# EAGLE design single-gates-THT (EAGLE 6.5.0)
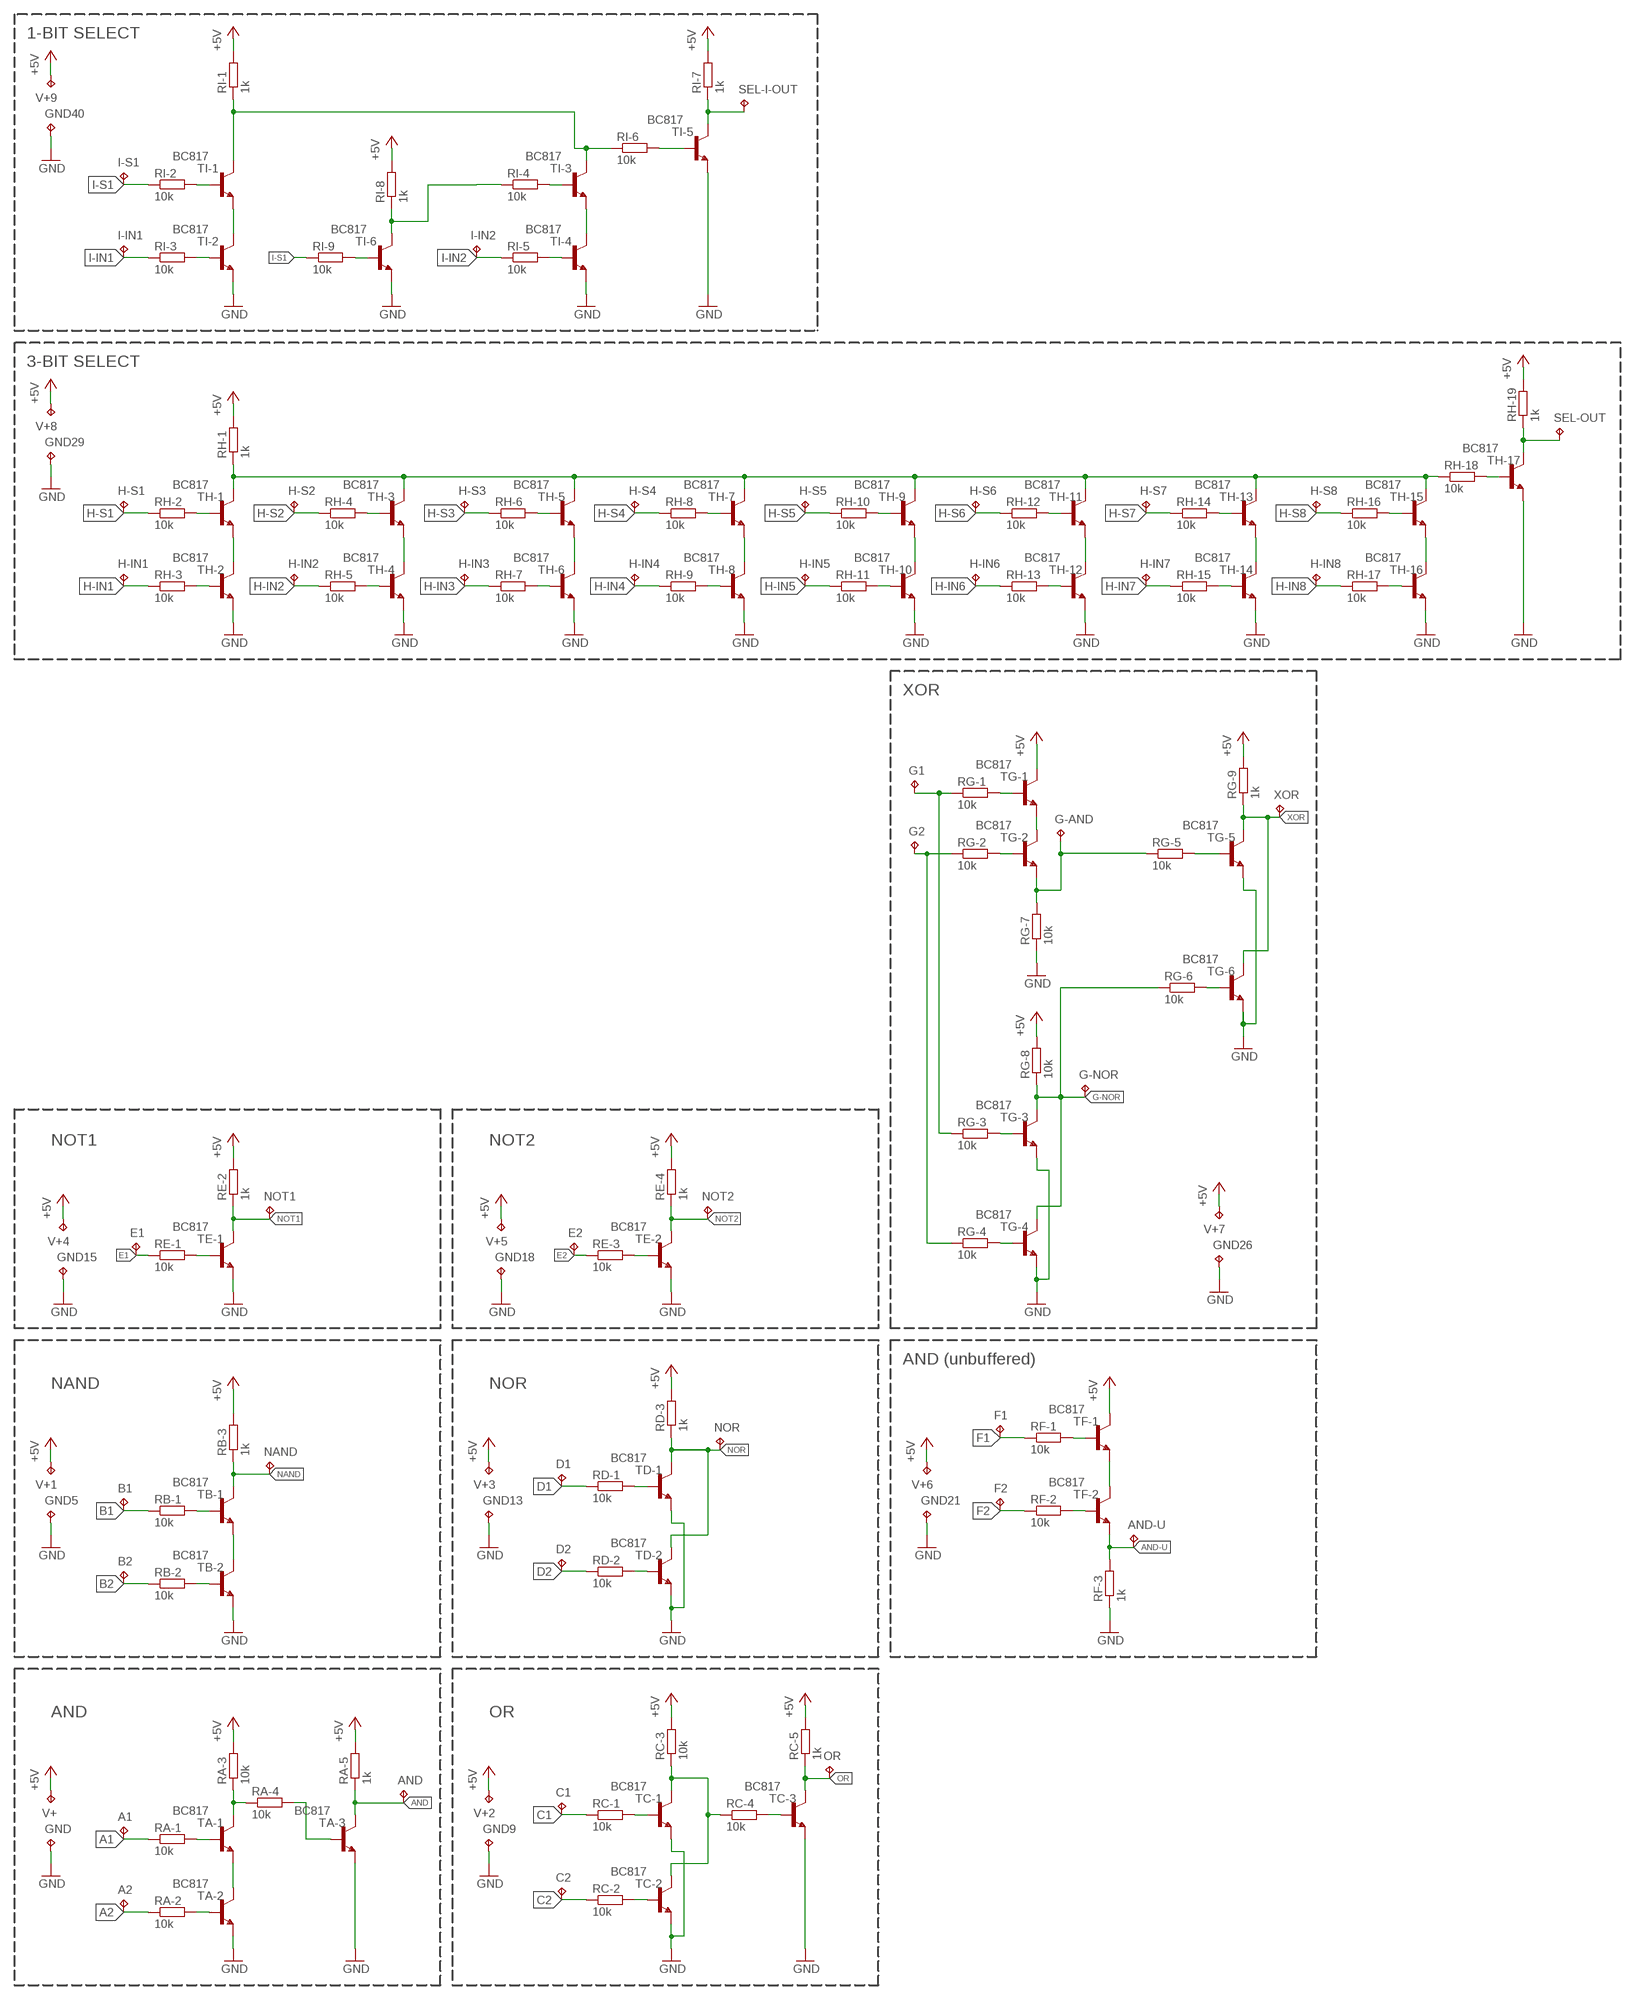
[diagram p0: schematic, sheet 1]

## Parts
A1  TPTP07R  [TP07R]
A2  TPTP07R  [TP07R]
AND  TPTP07R  [TP07R]
AND-U  TPTP07R  [TP07R]
B1  TPTP07R  [TP07R]
B2  TPTP07R  [TP07R]
C1  TPTP07R  [TP07R]
C2  TPTP07R  [TP07R]
D1  TPTP07R  [TP07R]
D2  TPTP07R  [TP07R]
E1  TPTP07R  [TP07R]
E2  TPTP07R  [TP07R]
F1  TPTP07R  [TP07R]
F2  TPTP07R  [TP07R]
G1  TPTP07R  [TP07R]
G2  TPTP07R  [TP07R]
G-AND  TPTP07R  [TP07R]
G-NOR  TPTP07R  [TP07R]
GND  TPTP07R  [TP07R]
GND5  TPTP07R  [TP07R]
GND9  TPTP07R  [TP07R]
GND13  TPTP07R  [TP07R]
GND15  TPTP07R  [TP07R]
GND18  TPTP07R  [TP07R]
GND21  TPTP07R  [TP07R]
GND26  TPTP07R  [TP07R]
GND29  TPTP07R  [TP07R]
GND40  TPTP07R  [TP07R]
H-IN1  TPTP07R  [TP07R]
H-IN2  TPTP07R  [TP07R]
H-IN3  TPTP07R  [TP07R]
H-IN4  TPTP07R  [TP07R]
H-IN5  TPTP07R  [TP07R]
H-IN6  TPTP07R  [TP07R]
H-IN7  TPTP07R  [TP07R]
H-IN8  TPTP07R  [TP07R]
H-S1  TPTP07R  [TP07R]
H-S2  TPTP07R  [TP07R]
H-S3  TPTP07R  [TP07R]
H-S4  TPTP07R  [TP07R]
H-S5  TPTP07R  [TP07R]
H-S6  TPTP07R  [TP07R]
H-S7  TPTP07R  [TP07R]
H-S8  TPTP07R  [TP07R]
I-IN1  TPTP07R  [TP07R]
I-IN2  TPTP07R  [TP07R]
I-S1  TPTP07R  [TP07R]
NAND  TPTP07R  [TP07R]
NOR  TPTP07R  [TP07R]
NOT1  TPTP07R  [TP07R]
NOT2  TPTP07R  [TP07R]
OR  TPTP07R  [TP07R]
RA-1  10k  R-EU_0207/7  [0207/7]
RA-2  10k  R-EU_0207/7  [0207/7]
RA-3  10k  R-EU_0207/7  [0207/7]
RA-4  10k  R-EU_0207/7  [0207/7]
RA-5  1k  R-EU_0207/7  [0207/7]
RB-1  10k  R-EU_0207/7  [0207/7]
RB-2  10k  R-EU_0207/7  [0207/7]
RB-3  1k  R-EU_0207/7  [0207/7]
RC-1  10k  R-EU_0207/7  [0207/7]
RC-2  10k  R-EU_0207/7  [0207/7]
RC-3  10k  R-EU_0207/7  [0207/7]
RC-4  10k  R-EU_0207/7  [0207/7]
RC-5  1k  R-EU_0207/7  [0207/7]
RD-1  10k  R-EU_0207/7  [0207/7]
RD-2  10k  R-EU_0207/7  [0207/7]
RD-3  1k  R-EU_0207/7  [0207/7]
RE-1  10k  R-EU_0207/7  [0207/7]
RE-2  1k  R-EU_0207/7  [0207/7]
RE-3  10k  R-EU_0207/7  [0207/7]
RE-4  1k  R-EU_0207/7  [0207/7]
RF-1  10k  R-EU_0207/7  [0207/7]
RF-2  10k  R-EU_0207/7  [0207/7]
RF-3  1k  R-EU_0207/7  [0207/7]
RG-1  10k  R-EU_0207/7  [0207/7]
RG-2  10k  R-EU_0207/7  [0207/7]
RG-3  10k  R-EU_0207/7  [0207/7]
RG-4  10k  R-EU_0207/7  [0207/7]
RG-5  10k  R-EU_0207/7  [0207/7]
RG-6  10k  R-EU_0207/7  [0207/7]
RG-7  10k  R-EU_0207/7  [0207/7]
RG-8  10k  R-EU_0207/7  [0207/7]
RG-9  1k  R-EU_0207/7  [0207/7]
RH-1  1k  R-EU_0207/7  [0207/7]
RH-2  10k  R-EU_0207/7  [0207/7]
RH-3  10k  R-EU_0207/7  [0207/7]
RH-4  10k  R-EU_0207/7  [0207/7]
RH-5  10k  R-EU_0207/7  [0207/7]
RH-6  10k  R-EU_0207/7  [0207/7]
RH-7  10k  R-EU_0207/7  [0207/7]
RH-8  10k  R-EU_0207/7  [0207/7]
RH-9  10k  R-EU_0207/7  [0207/7]
RH-10  10k  R-EU_0207/7  [0207/7]
RH-11  10k  R-EU_0207/7  [0207/7]
RH-12  10k  R-EU_0207/7  [0207/7]
RH-13  10k  R-EU_0207/7  [0207/7]
RH-14  10k  R-EU_0207/7  [0207/7]
RH-15  10k  R-EU_0207/7  [0207/7]
RH-16  10k  R-EU_0207/7  [0207/7]
RH-17  10k  R-EU_0207/7  [0207/7]
RH-18  10k  R-EU_0207/7  [0207/7]
RH-19  1k  R-EU_0207/7  [0207/7]
RI-1  1k  R-EU_0207/7  [0207/7]
RI-2  10k  R-EU_0207/7  [0207/7]
RI-3  10k  R-EU_0207/7  [0207/7]
RI-4  10k  R-EU_0207/7  [0207/7]
RI-5  10k  R-EU_0207/7  [0207/7]
RI-6  10k  R-EU_0207/7  [0207/7]
RI-7  1k  R-EU_0207/7  [0207/7]
RI-8  1k  R-EU_0207/7  [0207/7]
RI-9  10k  R-EU_0207/7  [0207/7]
SEL-I-OUT  TPTP07R  [TP07R]
SEL-OUT  TPTP07R  [TP07R]
TA-1  BC817  BC547A  [TO92]
TA-2  BC817  BC547A  [TO92]
TA-3  BC817  BC547A  [TO92]
TB-1  BC817  BC547A  [TO92]
TB-2  BC817  BC547A  [TO92]
TC-1  BC817  BC547A  [TO92]
TC-2  BC817  BC547A  [TO92]
TC-3  BC817  BC547A  [TO92]
TD-1  BC817  BC547A  [TO92]
TD-2  BC817  BC547A  [TO92]
TE-1  BC817  BC547A  [TO92]
TE-2  BC817  BC547A  [TO92]
TF-1  BC817  BC547A  [TO92]
TF-2  BC817  BC547A  [TO92]
TG-1  BC817  BC547A  [TO92]
TG-2  BC817  BC547A  [TO92]
TG-3  BC817  BC547A  [TO92]
TG-4  BC817  BC547A  [TO92]
TG-5  BC817  BC547A  [TO92]
TG-6  BC817  BC547A  [TO92]
TH-1  BC817  BC547A  [TO92]
TH-2  BC817  BC547A  [TO92]
TH-3  BC817  BC547A  [TO92]
TH-4  BC817  BC547A  [TO92]
TH-5  BC817  BC547A  [TO92]
TH-6  BC817  BC547A  [TO92]
TH-7  BC817  BC547A  [TO92]
TH-8  BC817  BC547A  [TO92]
TH-9  BC817  BC547A  [TO92]
TH-10  BC817  BC547A  [TO92]
TH-11  BC817  BC547A  [TO92]
TH-12  BC817  BC547A  [TO92]
TH-13  BC817  BC547A  [TO92]
TH-14  BC817  BC547A  [TO92]
TH-15  BC817  BC547A  [TO92]
TH-16  BC817  BC547A  [TO92]
TH-17  BC817  BC547A  [TO92]
TI-1  BC817  BC547A  [TO92]
TI-2  BC817  BC547A  [TO92]
TI-3  BC817  BC547A  [TO92]
TI-4  BC817  BC547A  [TO92]
TI-5  BC817  BC547A  [TO92]
TI-6  BC817  BC547A  [TO92]
V+  TPTP07R  [TP07R]
V+1  TPTP07R  [TP07R]
V+2  TPTP07R  [TP07R]
V+3  TPTP07R  [TP07R]
V+4  TPTP07R  [TP07R]
V+5  TPTP07R  [TP07R]
V+6  TPTP07R  [TP07R]
V+7  TPTP07R  [TP07R]
V+8  TPTP07R  [TP07R]
V+9  TPTP07R  [TP07R]
XOR  TPTP07R  [TP07R]

## Nets
+5V: RA-3.2 RA-5.2 RB-3.2 RC-3.2 RC-5.2 RD-3.2 RE-2.2 RE-4.2 RG-8.2 RG-9.2 RH-1.2 RH-19.2 RI-1.2 RI-7.2 RI-8.2 TF-1.3(C) TG-1.3(C) V+1.TP V+2.TP V+3.TP V+4.TP V+5.TP V+6.TP V+7.TP V+8.TP V+9.TP V+.TP
A1: A1.TP RA-1.1
A2: A2.TP RA-2.1
AND: AND.TP RA-5.1 TA-3.3(C)
AND-U: AND-U.TP RF-3.2 TF-2.1(E)
B1: B1.TP RB-1.1
B2: B2.TP RB-2.1
C1: C1.TP RC-1.1
C2: C2.TP RC-2.1
D1: D1.TP RD-1.1
D2: D2.TP RD-2.1
E1: E1.TP RE-1.1
E2: E2.TP RE-3.1
F1: F1.TP RF-1.1
F2: F2.TP RF-2.1
G-AND: G-AND.TP RG-5.1 RG-7.2 TG-2.1(E)
G-NOR: G-NOR.TP RG-6.1 RG-8.1 TG-3.3(C) TG-4.3(C)
GND: GND5.TP GND9.TP GND13.TP GND15.TP GND18.TP GND21.TP GND26.TP GND29.TP GND40.TP GND.TP RF-3.1 RG-7.1 TA-2.1(E) TA-3.1(E) TB-2.1(E) TC-1.1(E) TC-2.1(E) TC-3.1(E) TD-1.1(E) TD-2.1(E) TE-1.1(E) TE-2.1(E) TG-3.1(E) TG-4.1(E) TG-5.1(E) TG-6.1(E) TH-2.1(E) TH-4.1(E) TH-6.1(E) TH-8.1(E) TH-10.1(E) TH-12.1(E) TH-14.1(E) TH-16.1(E) TH-17.1(E) TI-2.1(E) TI-4.1(E) TI-5.1(E) TI-6.1(E)
H-IN1: H-IN1.TP RH-3.1
H-IN2: H-IN2.TP RH-5.1
H-IN3: H-IN3.TP RH-7.1
H-IN4: H-IN4.TP RH-9.1
H-IN5: H-IN5.TP RH-11.1
H-IN6: H-IN6.TP RH-13.1
H-IN7: H-IN7.TP RH-15.1
H-IN8: H-IN8.TP RH-17.1
H-S1: H-S1.TP RH-2.1
H-S2: H-S2.TP RH-4.1
H-S3: H-S3.TP RH-6.1
H-S4: H-S4.TP RH-8.1
H-S5: H-S5.TP RH-10.1
H-S6: H-S6.TP RH-12.1
H-S7: H-S7.TP RH-14.1
H-S8: H-S8.TP RH-16.1
I-IN1: I-IN1.TP RI-3.1
I-IN2: I-IN2.TP RI-5.1
I-S1: I-S1.TP RI-2.1 RI-9.1
I-S2: RI-4.1 RI-8.1 TI-6.3(C)
N$1: RA-1.2 TA-1.2(B)
N$2: RA-3.1 RA-4.1 TA-1.3(C)
N$3: RA-2.2 TA-2.2(B)
N$4: TA-1.1(E) TA-2.3(C)
N$5: RB-1.2 TB-1.2(B)
N$6: RB-2.2 TB-2.2(B)
N$7: RC-1.2 TC-1.2(B)
N$8: TB-1.1(E) TB-2.3(C)
N$9: RC-2.2 TC-2.2(B)
N$10: RC-4.2 TC-3.2(B)
N$11: RC-3.1 RC-4.1 TC-1.3(C) TC-2.3(C)
N$12: RD-1.2 TD-1.2(B)
N$13: RD-2.2 TD-2.2(B)
N$14: RE-1.2 TE-1.2(B)
N$15: RA-4.2 TA-3.2(B)
N$16: RE-3.2 TE-2.2(B)
N$17: RF-1.2 TF-1.2(B)
N$18: RF-2.2 TF-2.2(B)
N$19: TG-1.1(E) TG-2.3(C)
N$20: TF-1.1(E) TF-2.3(C)
N$21: RG-1.2 TG-1.2(B)
N$22: RG-2.2 TG-2.2(B)
N$23: RG-4.2 TG-4.2(B)
N$24: RG-3.2 TG-3.2(B)
N$25: RG-6.2 TG-6.2(B)
N$26: RG-5.2 TG-5.2(B)
N$27: RH-2.2 TH-1.2(B)
N$28: RH-3.2 TH-2.2(B)
N$29: TH-1.1(E) TH-2.3(C)
N$30: G1.TP RG-1.1 RG-3.1
N$31: G2.TP RG-2.1 RG-4.1
N$32: RH-4.2 TH-3.2(B)
N$33: RH-5.2 TH-4.2(B)
N$34: TH-3.1(E) TH-4.3(C)
N$35: RH-6.2 TH-5.2(B)
N$36: RH-7.2 TH-6.2(B)
N$37: TH-5.1(E) TH-6.3(C)
N$38: RH-8.2 TH-7.2(B)
N$39: RH-9.2 TH-8.2(B)
N$40: TH-7.1(E) TH-8.3(C)
N$41: RH-10.2 TH-9.2(B)
N$42: RH-11.2 TH-10.2(B)
N$43: TH-9.1(E) TH-10.3(C)
N$44: RH-12.2 TH-11.2(B)
N$45: RH-13.2 TH-12.2(B)
N$46: TH-11.1(E) TH-12.3(C)
N$47: RH-14.2 TH-13.2(B)
N$48: RH-15.2 TH-14.2(B)
N$49: TH-13.1(E) TH-14.3(C)
N$50: RH-16.2 TH-15.2(B)
N$51: RH-17.2 TH-16.2(B)
N$52: TH-15.1(E) TH-16.3(C)
N$53: RI-2.2 TI-1.2(B)
N$54: RH-18.2 TH-17.2(B)
N$55: RI-3.2 TI-2.2(B)
N$56: TI-1.1(E) TI-2.3(C)
N$57: RI-4.2 TI-3.2(B)
N$58: RI-5.2 TI-4.2(B)
N$59: TI-3.1(E) TI-4.3(C)
N$60: RI-6.2 TI-5.2(B)
N$62: RI-9.2 TI-6.2(B)
NAND: NAND.TP RB-3.1 TB-1.3(C)
NOR: NOR.TP RD-3.1 TD-1.3(C) TD-2.3(C)
NOT1: NOT1.TP RE-2.1 TE-1.3(C)
NOT2: NOT2.TP RE-4.1 TE-2.3(C)
OR: OR.TP RC-5.1 TC-3.3(C)
SEL_INT: RH-1.1 RH-18.1 TH-1.3(C) TH-3.3(C) TH-5.3(C) TH-7.3(C) TH-9.3(C) TH-11.3(C) TH-13.3(C) TH-15.3(C)
SEL_INT1: RI-1.1 RI-6.1 TI-1.3(C) TI-3.3(C)
SEL_OUT: RH-19.1 SEL-OUT.TP TH-17.3(C)
SEL_OUT1: RI-7.1 SEL-I-OUT.TP TI-5.3(C)
XOR: RG-9.1 TG-5.3(C) TG-6.3(C) XOR.TP

## Notes on the sheet
- 1-BIT SELECT
- 3-BIT SELECT
- XOR
- NOT1 | NOT2
- AND (unbuffered)
- NAND | NOR
- AND | OR

## Library data of the parts
A1 A2 AND AND-U B1 B2 C1 C2 D1 D2 E1 E2 F1 F2 G1 G2 G-AND G-NOR GND GND5 GND9 GND13 GND15 GND18 GND21 GND26 GND29 GND40 H-IN1-H-IN8 H-S1-H-S8 I-IN1 I-IN2 I-S1 NAND NOR NOT1 NOT2 OR SEL-I-OUT SEL-OUT V+ V+1-V+9 XOR = testpad:TP: Test pad
RA-1-RA-5 RB-1-RB-3 RC-1-RC-5 RD-1-RD-3 RE-1-RE-4 RF-1-RF-3 RG-1-RG-9 RH-1-RH-19 RI-1-RI-9 = rcl:R-EU_: RESISTOR, European symbol
TA-1-TA-3 TB-1 TB-2 TC-1-TC-3 TD-1 TD-2 TE-1 TE-2 TF-1 TF-2 TG-1-TG-6 TH-1-TH-17 TI-1-TI-6 = transistor-npn:BC547*: NPN Transistor

## Board
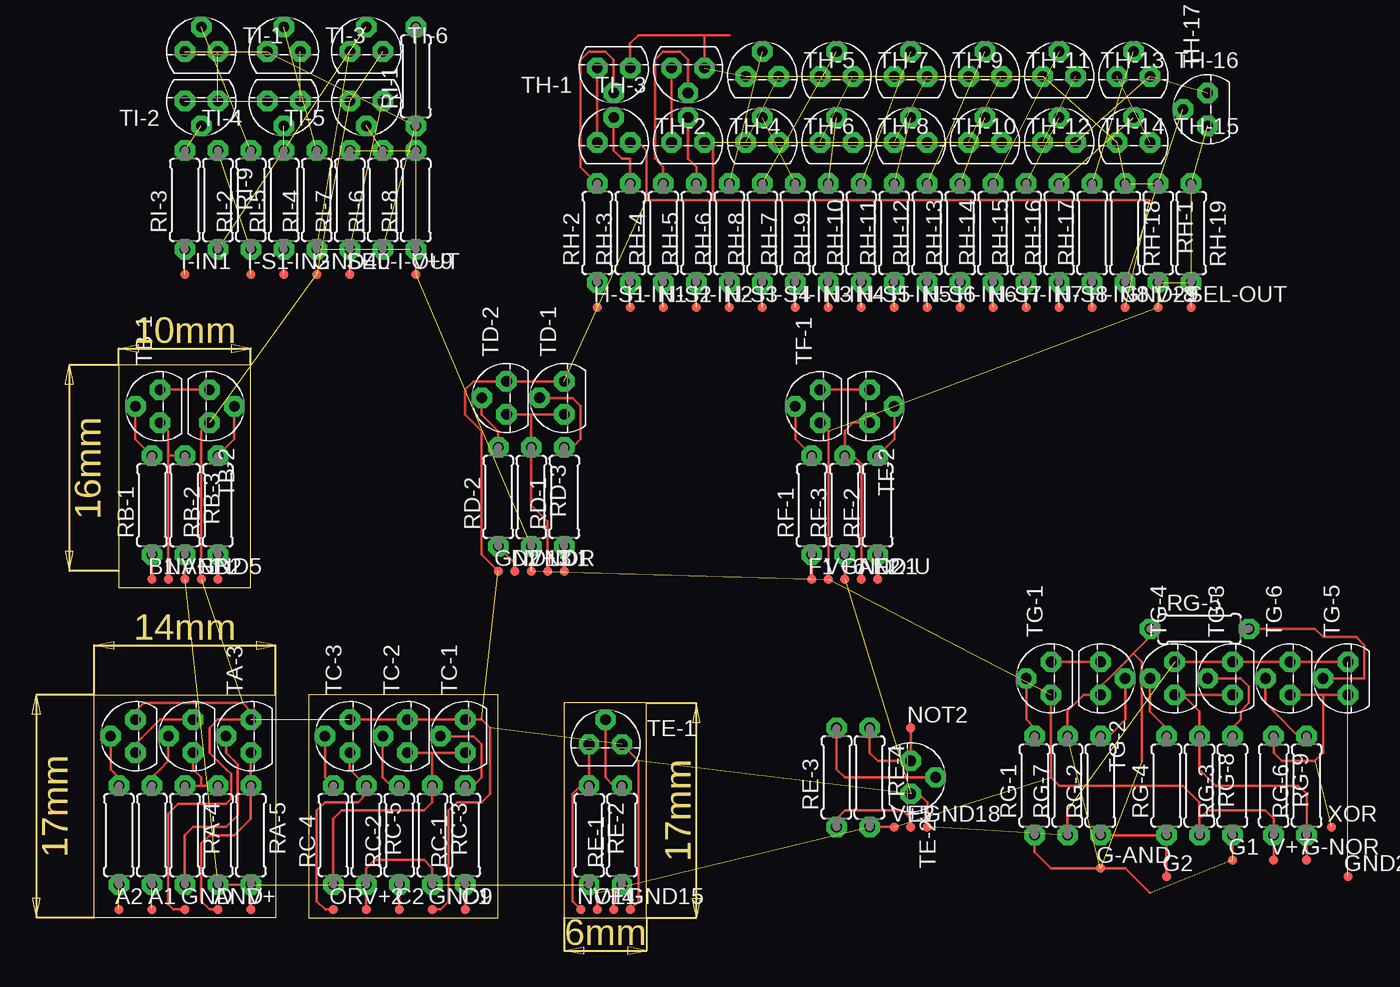
[diagram p1: board, top side]
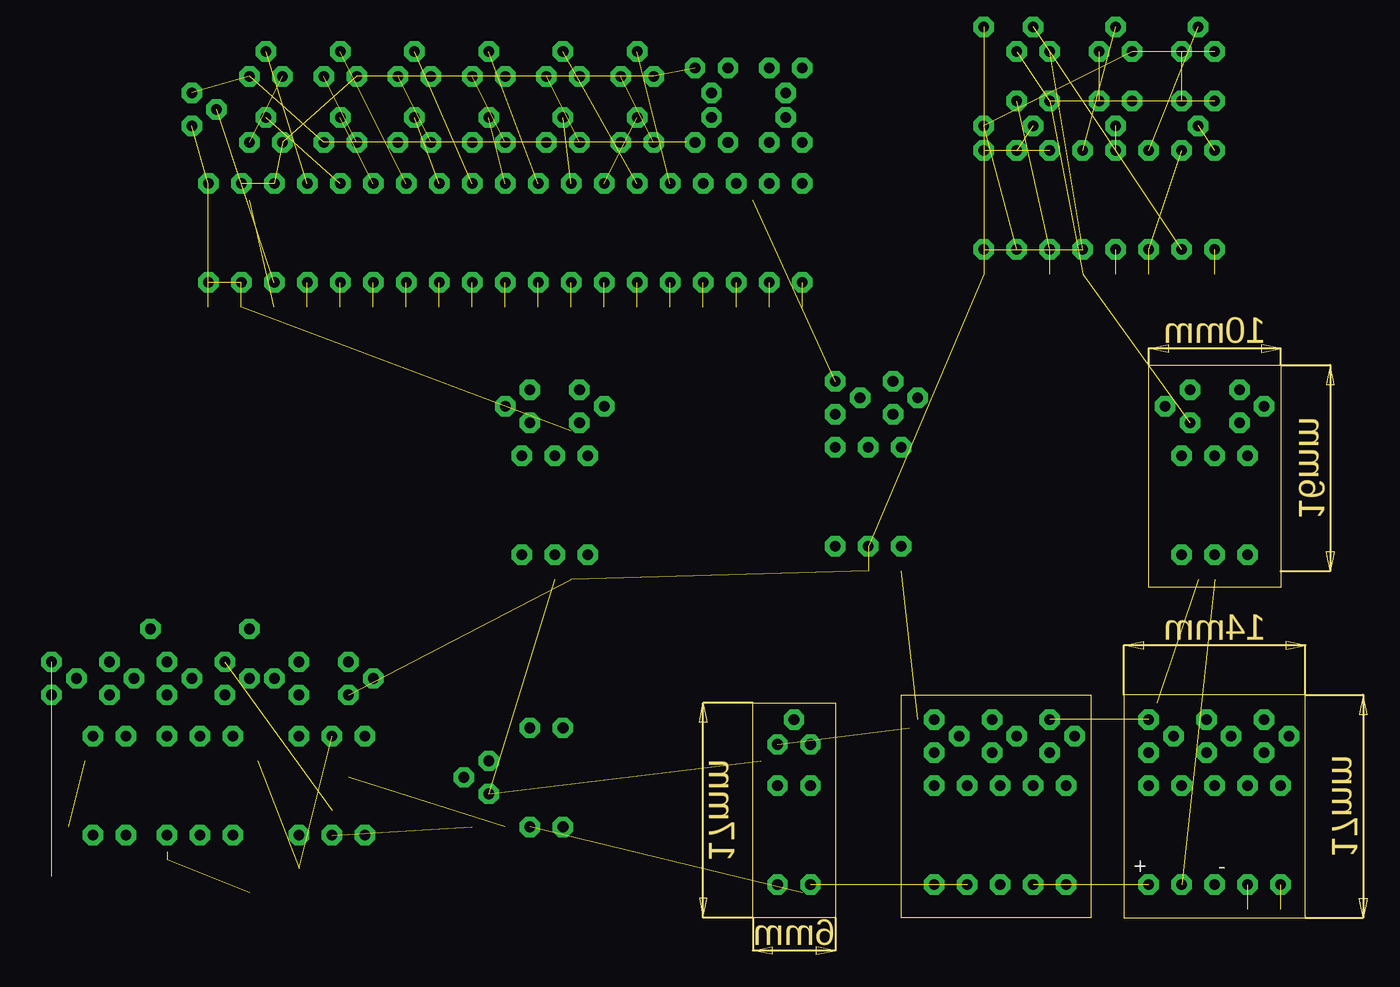
[diagram p2: board, bottom side, seen from below]

Size 51.4 x 46.95 mm. Coordinates in mm from the lower left corner, seen from the top.
Outline: 4.75,2.84 4.75,19.98 18.71,19.98 18.71,2.84 4.75,2.84
Outline: 6.65,45.39 6.65,28.24 16.81,28.24 16.81,45.39 6.65,45.39
Outline: 40.94,2.84 47.29,2.84 47.29,19.35 40.94,19.35 40.94,2.84
Outline: 21.89,2.84 35.86,2.84 35.86,19.98 21.26,19.98 21.26,2.84 21.89,2.84
Copper layers (1*16): Top 0.035mm / dielectric 1.5mm / Bottom 0.035mm
Design rules "Fusion_eagle_rule_v1.1 *": minimum track width 6mil, minimum drill 12mil, track to track 6mil, track to pad 6mil, pad to pad 6mil, via to via 6mil, smd to smd 0mil, copper to edge 10mil, drill to drill 10mil, minimum pad ring 15mil, minimum via ring 6mil, stop-mask expansion 2mil, vias tented up to drill 100mil, thermal gap 10mil

### Footprints (pad centres in the part's own frame; a part is rotated, then mirrored left to right if it is on the bottom)
TP07R = smd 0.7 x 0.7: TP 0,0
0207/7 = drill 0.813 octagon: 1 -3.81,0; 2 3.81,0
TO92 = drill 0.813 octagon: 1 1.27,0; 2 0,1.905; 3 -1.27,0

### Placement (x,y rotation side)
A1  9.19,3.47 0 top
A2  6.65,3.47 0 top
AND  14.27,3.47 0 top
AND-U  63.8,28.88 0 top  (outside the outline)
B1  9.19,28.88 0 top
B2  14.27,28.88 0 top
C1  33.32,3.47 0 top
C2  28.24,3.47 0 top
D1  40.94,29.51 0 top
D2  37.13,29.51 0 top
E1  44.75,3.47 0 top
E2  67.61,9.82 0 top  (outside the outline)
F1  59.99,28.88 0 top  (outside the outline)
F2  65.07,28.88 0 top  (outside the outline)
G1  92.38,7.29 0 top  (outside the outline)
G2  87.29,6.01 0 top  (outside the outline)
G-AND  82.21,6.65 0 top  (outside the outline)
G-NOR  98.09,7.29 0 top  (outside the outline)
GND  11.73,3.47 0 top
GND5  13,28.88 0 top
GND9  30.78,3.47 0 top
GND13  35.86,29.51 0 top
GND15  46.02,3.47 0 top
GND18  68.88,9.82 0 top  (outside the outline)
GND21  62.53,28.88 0 top  (outside the outline)
GND26  101.27,6.01 0 top  (outside the outline)
GND29  84.12,49.83 0 top  (outside the outline)
GND40  21.89,52.37 0 top  (outside the outline)
H-IN1  46.02,49.83 0 top
H-IN2  51.1,49.83 0 top
H-IN3  58.72,49.83 0 top  (outside the outline)
H-IN4  61.26,49.83 0 top  (outside the outline)
H-IN5  66.34,49.83 0 top  (outside the outline)
H-IN6  71.42,49.83 0 top  (outside the outline)
H-IN7  76.5,49.83 0 top  (outside the outline)
H-IN8  81.58,49.83 0 top  (outside the outline)
H-S1  43.48,49.83 0 top
H-S2  48.56,49.83 0 top
H-S3  53.64,49.83 0 top
H-S4  56.18,49.83 0 top  (outside the outline)
H-S5  63.8,49.83 0 top  (outside the outline)
H-S6  68.88,49.83 0 top  (outside the outline)
H-S7  73.96,49.83 0 top  (outside the outline)
H-S8  79.04,49.83 0 top  (outside the outline)
I-IN1  11.73,52.37 0 top  (outside the outline)
I-IN2  19.35,52.37 0 top  (outside the outline)
I-S1  16.81,52.37 0 top  (outside the outline)
NAND  10.46,28.88 0 top
NOR  39.67,29.51 0 top
NOT1  42.21,3.47 0 top
NOT2  67.61,17.45 0 top  (outside the outline)
OR  23.16,3.47 0 top
RA-1  9.19,9.19 90 top
RA-2  6.65,9.19 90 top
RA-3  14.27,9.19 270 top
RA-4  11.73,9.19 270 top
RA-5  16.81,9.19 270 top
RB-1  9.19,34.59 90 top
RB-2  14.27,34.59 90 top
RB-3  11.73,34.59 270 top
RC-1  33.32,9.19 90 top
RC-2  28.24,9.19 90 top
RC-3  30.78,9.19 270 top
RC-4  23.16,9.19 90 top
RC-5  25.7,9.19 270 top
RD-1  40.94,35.22 90 top
RD-2  35.86,35.22 90 top
RD-3  38.4,35.22 270 top
RE-1  45.38,9.19 90 top
RE-2  42.84,9.19 270 top
RE-3  61.9,13.63 90 top  (outside the outline)
RE-4  64.44,13.63 270 top  (outside the outline)
RF-1  59.99,34.59 90 top  (outside the outline)
RF-2  65.07,34.59 90 top  (outside the outline)
RF-3  62.53,34.59 90 top  (outside the outline)
RG-1  77.13,13 90 top  (outside the outline)
RG-2  82.21,13 90 top  (outside the outline)
RG-3  92.38,13 90 top  (outside the outline)
RG-4  87.29,13 90 top  (outside the outline)
RG-5  89.83,25.07 0 top  (outside the outline)
RG-6  98.09,13 90 top  (outside the outline)
RG-7  79.67,13 90 top  (outside the outline)
RG-8  89.83,13 270 top  (outside the outline)
RG-9  95.55,13 270 top  (outside the outline)
RH-1  86.66,55.55 270 top  (outside the outline)
RH-2  43.48,55.55 90 top  (outside the outline)
RH-3  46.02,55.55 90 top  (outside the outline)
RH-4  48.56,55.55 90 top  (outside the outline)
RH-5  51.1,55.55 90 top  (outside the outline)
RH-6  53.64,55.55 90 top  (outside the outline)
RH-7  58.72,55.55 90 top  (outside the outline)
RH-8  56.18,55.55 90 top  (outside the outline)
RH-9  61.26,55.55 90 top  (outside the outline)
RH-10  63.8,55.55 90 top  (outside the outline)
RH-11  66.34,55.55 90 top  (outside the outline)
RH-12  68.88,55.55 90 top  (outside the outline)
RH-13  71.42,55.55 90 top  (outside the outline)
RH-14  73.96,55.55 90 top  (outside the outline)
RH-15  76.5,55.55 90 top  (outside the outline)
RH-16  79.04,55.55 90 top  (outside the outline)
RH-17  81.58,55.55 90 top  (outside the outline)
RH-18  84.12,55.55 270 top  (outside the outline)
RH-19  89.2,55.55 270 top  (outside the outline)
RI-1  29.51,67.61 90 top  (outside the outline)
RI-2  16.81,58.08 90 top  (outside the outline)
RI-3  11.73,58.08 90 top  (outside the outline)
RI-4  21.89,58.08 90 top  (outside the outline)
RI-5  19.35,58.08 90 top  (outside the outline)
RI-6  26.97,58.08 90 top  (outside the outline)
RI-7  24.43,58.08 90 top  (outside the outline)
RI-8  29.51,58.08 90 top  (outside the outline)
RI-9  14.27,58.08 270 top  (outside the outline)
SEL-I-OUT  24.43,52.37 0 top  (outside the outline)
SEL-OUT  89.2,49.83 0 top  (outside the outline)
TA-1  12.37,16.81 90 top
TA-2  7.92,16.81 90 top
TA-3  16.81,16.81 90 top
TB-1  9.82,42.21 90 top
TB-2  13.63,42.21 270 top
TC-1  33.32,16.81 90 top
TC-2  28.88,16.81 90 top
TC-3  24.43,16.81 90 top
TD-1  40.94,42.84 90 top
TD-2  36.5,42.84 90 top
TE-1  44.12,16.18 0 top
TE-2  67.61,13.63 270 top  (outside the outline)
TF-1  60.62,42.21 90 top  (outside the outline)
TF-2  64.44,42.21 270 top  (outside the outline)
TG-1  78.41,21.25 90 top  (outside the outline)
TG-2  82.21,21.25 270 top  (outside the outline)
TG-3  92.38,21.25 90 top  (outside the outline)
TG-4  87.93,21.25 90 top  (outside the outline)
TG-5  101.27,21.25 90 top  (outside the outline)
TG-6  96.82,21.25 90 top  (outside the outline)
TH-1  44.75,68.25 180 top  (outside the outline)
TH-2  44.75,62.53 0 top  (outside the outline)
TH-3  50.47,68.25 180 top  (outside the outline)
TH-4  50.47,62.53 0 top  (outside the outline)
TH-5  56.18,67.61 0 top  (outside the outline)
TH-6  56.18,62.53 0 top  (outside the outline)
TH-7  61.9,67.61 0 top  (outside the outline)
TH-8  61.9,62.53 0 top  (outside the outline)
TH-9  67.61,67.61 0 top  (outside the outline)
TH-10  67.61,62.53 0 top  (outside the outline)
TH-11  73.32,67.61 0 top  (outside the outline)
TH-12  73.32,62.53 0 top  (outside the outline)
TH-13  79.04,67.61 0 top  (outside the outline)
TH-14  79.04,62.53 0 top  (outside the outline)
TH-15  84.75,62.53 0 top  (outside the outline)
TH-16  84.75,67.61 0 top  (outside the outline)
TH-17  90.47,65.07 90 top  (outside the outline)
TI-1  13,69.52 0 top  (outside the outline)
TI-2  13,65.7 180 top  (outside the outline)
TI-3  19.35,69.52 0 top  (outside the outline)
TI-4  19.35,65.7 180 top  (outside the outline)
TI-5  25.7,65.7 180 top  (outside the outline)
TI-6  25.7,69.52 0 top  (outside the outline)
V+  16.81,3.47 0 top
V+1  11.73,28.88 0 top
V+2  25.7,3.47 0 top
V+3  38.4,29.51 0 top
V+4  43.48,3.47 0 top
V+5  66.34,9.82 0 top  (outside the outline)
V+6  61.26,28.88 0 top  (outside the outline)
V+7  95.55,7.29 0 top  (outside the outline)
V+8  86.66,49.83 0 top  (outside the outline)
V+9  29.51,52.37 0 top  (outside the outline)
XOR  99.99,9.82 0 top  (outside the outline)

### Tracks (layer width: path | path; a pad name or v marks a point on that pad's centre or on a via)
+5V  (15 unrouted)
  Top 0.203: RA-3.2 RA-5.2 V+.TP | RE-2.2 43.48,4.75 V+4.TP | RC-3.2 30.78,6.65 30.15,7.29 26.34,7.29 25.7,6.65 RC-5.2 V+2.TP | RE-4.2 V+5.TP | V+6.TP 61.26,40.31 TF-1.3 | V+1.TP RB-3.2 | TG-1.3 78.41,13.63 79.04,13 84.12,13 88.56,13 89.83,11.73 89.83,9.82 | V+7.TP RG-9.2 95.55,10.46 94.91,11.1 90.47,11.1 89.83,10.46 89.83,9.82 | 89.83,9.82 RG-8.2
A1  (1 unrouted)
A2  (1 unrouted)
AND
  Top 0.203: RA-5.1 TA-3.3 RA-5.1 | RA-5.1 16.81,10.46 15.54,9.19 13.63,9.19 13,8.55 13,4.11 13.63,3.47 AND.TP
AND-U
  Top 0.203: AND-U.TP 63.8,37.77 63.16,38.4 RF-3.2 62.53,40.31 63.16,40.94 TF-2.1
B1
  Top 0.203: B1.TP RB-1.1
B2
  Top 0.203: B2.TP RB-2.1
C1
  Top 0.203: C1.TP RC-1.1
C2
  Top 0.203: RC-2.1 C2.TP
D1
  Top 0.203: D1.TP RD-1.1
D2
  Top 0.203: RD-2.1 37.13,30.14 D2.TP
E1
  Top 0.203: RE-1.1 44.75,4.75 E1.TP
E2
  Top 0.203: E2.TP 67.61,10.46 66.97,11.1 62.53,11.1 61.9,10.46 RE-3.1
F1
  Top 0.203: F1.TP RF-1.1
F2
  Top 0.203: F2.TP RF-2.1
G-AND  (2 unrouted)
  Top 0.203: RG-7.2 79.67,18.71 80.94,19.98 TG-2.1 82.21,20.62 82.85,21.25 84.12,22.52 84.75,23.16 | 84.75,23.16 86.02,24.43 84.75,23.16 | 84.75,23.16 85.39,22.52 85.39,14.9
G-NOR
  Top 0.203: 88.56,19.98 89.83,18.71 RG-8.1 89.83,14.27 91.1,13 97.45,13 98.09,12.37 RG-6.1 98.09,7.92 G-NOR.TP | 88.56,19.98 TG-3.3 | TG-4.3 88.56,19.98
GND  (23 unrouted)
  Top 0.203: TA-2.1 7.92,18.71 8.55,19.35 16.18,19.35 16.81,18.71 TA-3.1 14.27,18.08 13.63,17.45 13.63,15.54 14.27,14.9 14.9,14.27 15.29,13.89 15.29,11.98 14.9,11.6 11.22,11.6 10.46,10.84 10.46,3.86 10.84,3.47 GND.TP | TE-1.1 46.66,14.9 46.66,4.11 GND15.TP | TC-3.1 TC-2.1 TC-1.1 34.59,18.08 35.23,17.45 35.23,12.37 34.59,11.73 32.69,11.73 32.05,11.1 32.05,4.11 31.42,3.47 GND9.TP | GND18.TP 68.88,11.73 68.24,12.37 TE-2.1 | GND21.TP RF-3.1 | TD-1.1 TD-2.1 33.95,44.11 33.32,43.48 33.32,41.58 34.59,40.31 34.59,30.78 GND13.TP | GND5.TP 13,40.31 TB-2.1 | TG-4.1 TG-3.1 TG-6.1 TG-5.1 | RG-7.1 79.67,11.1 | TH-2.1 46.66,62.53 47.29,61.89 47.29,58.08 52.37,58.08 | 52.37,58.08 86.02,58.08 | TH-4.1 52.37,62.53 52.37,58.08
H-IN1  (1 unrouted)
H-IN2  (1 unrouted)
H-IN3  (1 unrouted)
H-IN4  (1 unrouted)
H-IN5  (1 unrouted)
H-IN6  (1 unrouted)
H-IN7  (1 unrouted)
H-IN8  (1 unrouted)
H-S1  (1 unrouted)
H-S2  (1 unrouted)
H-S3  (1 unrouted)
H-S4  (1 unrouted)
H-S5  (1 unrouted)
H-S6  (1 unrouted)
H-S7  (1 unrouted)
H-S8  (1 unrouted)
I-IN1  (1 unrouted)
I-IN2  (1 unrouted)
I-S1  (2 unrouted)
I-S2  (2 unrouted)
N$1
  Top 0.203: RA-1.2 9.19,13.63 9.82,14.27 10.46,14.9 TA-1.2
N$2
  Top 0.203: RA-4.1 13,13 | 13,13 RA-3.1 | TA-1.3 12.37,14.27 13,13.63 13,13
N$3
  Top 0.203: RA-2.2 6.65,13.63 6.02,14.27 TA-2.2
N$4
  Top 0.203: TA-2.3 7.92,16.18 9.19,17.45 9.82,18.08 TA-1.1
N$5
  Top 0.203: RB-1.2 7.92,39.67 TB-1.2
N$6
  Top 0.203: RB-2.2 15.54,39.67 TB-2.2
N$7
  Top 0.203: TC-1.2 33.95,16.81 34.59,16.18 34.59,13.63 33.95,13 RC-1.2
N$8
  Top 0.203: TB-1.1 TB-2.3
N$9
  Top 0.203: TC-2.2 26.97,13.63 27.61,13 RC-2.2
N$10
  Top 0.203: TC-3.2 22.53,13.63 RC-4.2
N$11
  Top 0.203: 30.78,15.54 RC-3.1 30.78,11.73 30.15,11.1 23.8,11.1 23.16,10.46 RC-4.1 | 30.78,15.54 TC-2.3 | TC-1.3 30.78,15.54
N$12
  Top 0.203: TD-1.2 41.58,42.84 42.21,42.21 42.21,39.67 41.58,39.03 RD-1.2
N$13
  Top 0.203: RD-2.2 35.86,40.31 34.59,41.58 TD-2.2
N$14
  Top 0.203: RE-1.2 44.75,13 44.12,13.63 TE-1.2
N$15
  Top 0.203: TA-3.2 14.9,15.54 15.54,14.9 15.79,14.65 15.79,10.71 14.9,9.82 12.37,9.82 11.73,9.19 RA-4.2
N$16
  Top 0.203: RE-3.2 61.9,14.27 62.53,13.63 TE-2.2
N$17
  Top 0.203: RF-1.2 58.72,39.67 TF-1.2
N$18
  Top 0.203: RF-2.2 66.34,39.67 TF-2.2
N$19
  Top 0.203: TG-1.1 TG-2.3
N$20
  Top 0.203: TF-1.1 TF-2.3
N$21
  Top 0.203: RG-1.2 77.13,17.45 76.5,18.08 TG-1.2
N$22
  Top 0.203: RG-2.2 82.85,16.81 84.12,18.08 TG-2.2
N$23
  Top 0.203: RG-4.2 87.29,17.45 86.02,18.71 TG-4.2
N$24
  Top 0.203: RG-3.2 92.38,17.45 93.01,18.08 93.01,18.71 93.64,19.35 93.64,20.62 93.01,21.25 TG-3.2
N$25
  Top 0.203: TG-6.2 94.91,19.35 95.55,18.71 97.45,16.81 RG-6.2
N$26
  Top 0.203: RG-5.2 98.72,25.07 99.36,24.43 101.9,24.43 102.53,23.79 102.53,21.25 TG-5.2
N$27
  Top 0.203: RH-2.2 42.21,60.62 42.21,68.88 42.84,69.52 44.12,69.52 44.75,68.88 TH-1.2
N$28
  Top 0.203: RH-3.2 46.02,61.26 45.38,61.26 44.75,61.89 TH-2.2
N$29
  Top 0.203: TH-2.3 TH-1.1
N$30  (2 unrouted)
  Top 0.203: RG-3.1 92.38,7.92 | RG-1.1 77.13,7.92 78.41,6.65 84.12,6.65 86.02,4.75
N$31
  Top 0.203: RG-2.1 RG-4.1 G2.TP
N$32
  Top 0.203: RH-4.2 48.56,60.62 47.93,61.26 47.93,65.07 47.93,68.88 48.56,69.52 49.83,69.52 50.47,68.88 TH-3.2
N$33
  Top 0.203: RH-5.2 51.1,60.62 50.47,61.26 TH-4.2
N$34
  Top 0.203: TH-3.1 TH-4.3
N$35  (1 unrouted)
N$36  (1 unrouted)
N$37  (1 unrouted)
N$38  (1 unrouted)
N$39  (1 unrouted)
N$40  (1 unrouted)
N$41  (1 unrouted)
N$42  (1 unrouted)
N$43  (1 unrouted)
N$44  (1 unrouted)
N$45  (1 unrouted)
N$46  (1 unrouted)
N$47  (1 unrouted)
N$48  (1 unrouted)
N$49  (1 unrouted)
N$50  (1 unrouted)
N$51  (1 unrouted)
N$52  (1 unrouted)
N$53  (1 unrouted)
N$54  (1 unrouted)
N$55  (1 unrouted)
N$56  (1 unrouted)
N$57  (1 unrouted)
N$58  (1 unrouted)
N$59  (1 unrouted)
N$60  (1 unrouted)
N$62  (1 unrouted)
NAND
  Top 0.203: NAND.TP 10.46,38.4 | 10.46,38.4 10.46,40.31 TB-1.3 | RB-3.1 10.46,38.4
NOR
  Top 0.203: TD-1.3 38.4,41.58 | 38.4,41.58 TD-2.3 | 38.4,41.58 RD-3.1 38.4,34.59 39.67,33.32 NOR.TP
NOT1
  Top 0.203: TE-1.3 RE-2.1 42.21,13 41.58,12.37 41.58,4.11 NOT1.TP
NOT2
  Top 0.203: RE-4.1 64.44,15.54 65.07,14.9 TE-2.3 NOT2.TP
OR
  Top 0.203: TC-3.3 24.43,14.27 RC-5.1 25.7,12.37 25.07,11.73 22.53,11.73 21.89,11.1 21.89,4.11 22.53,3.47 OR.TP
SEL_INT  (8 unrouted)
  Top 0.203: TH-1.3 46.02,70.15 46.66,70.78 51.73,70.78 | 51.73,70.78 53.64,70.78 | TH-3.3 51.73,70.78
SEL_INT1  (3 unrouted)
SEL_OUT  (2 unrouted)
SEL_OUT1  (2 unrouted)
XOR  (1 unrouted)
  Top 0.203: 98.09,19.98 TG-6.3 99.36,19.98 | 99.36,19.98 TG-5.3 | RG-9.1 95.55,15.54 96.18,14.9 98.72,14.9 99.36,15.54 99.36,19.98

### Text on the board
bPlace: - | +
tStop: lizard / v0.1
Document: 1-Bit SELECT | 3-Bit SELECT | NAND | NOR | AND | XOR | AND | OR | NOT | NOT